# Altium schematic sheet MioShield.SchDoc
size A4
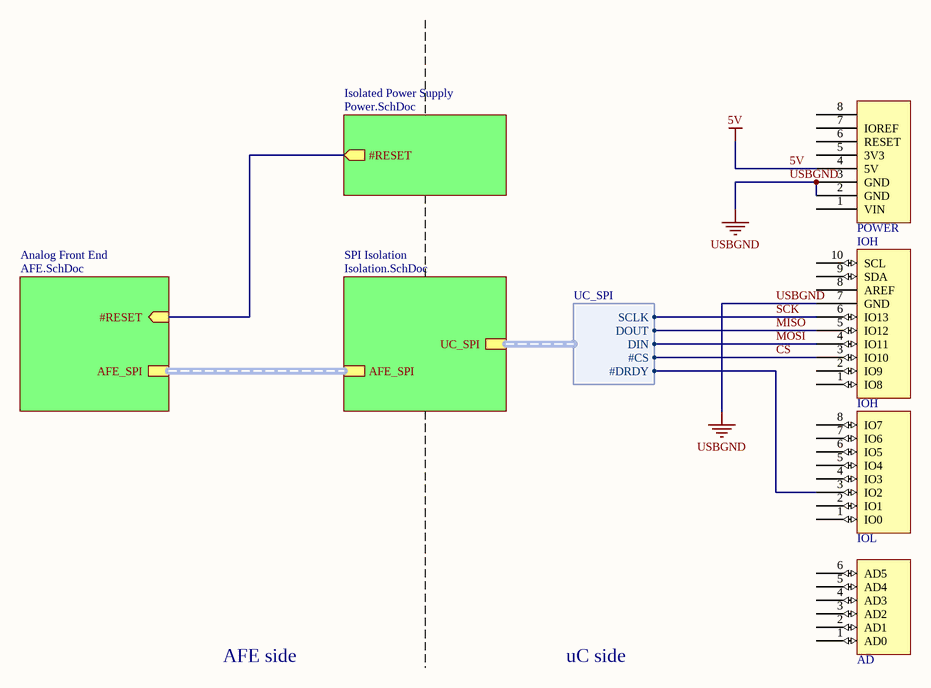
[diagram p0: MioShield.SchDoc]

## Parts
AD  AD  [Header 6x1 8.5mm]  (value not drawn)
IOH  IOH  [Header 10x1 8.5mm]
IOL  IOL  [Header 8x1 8.5mm]  (value not drawn)
POWER  POWER_UNO  [Header 8x1 8.5mm]  (value not drawn)

## Sub-sheets
Analog Front End = AFE.SchDoc: #RESET (in), AFE_SPI (harness AFE_SPI)
Isolated Power Supply = Power.SchDoc: #RESET (out)
SPI Isolation = Isolation.SchDoc: AFE_SPI (harness AFE_SPI), UC_SPI (harness UC_SPI)

## Harnesses
UC_SPI: #CS, #DRDY, DIN, DOUT, SCLK

## Nets
5V: POWER.4(5V)
USBGND: IOH.7(GND) POWER.2(GND) POWER.3(GND)
CS: IOH.3(IO10) ; sheet SPI Isolation/UC_SPI.#CS
MISO: IOH.5(IO12) ; sheet SPI Isolation/UC_SPI.DOUT
MOSI: IOH.4(IO11) ; sheet SPI Isolation/UC_SPI.DIN
SCK: IOH.6(IO13) ; sheet SPI Isolation/UC_SPI.SCLK
NetIOL_3: IOL.3(IO2) ; sheet SPI Isolation/UC_SPI.#DRDY
(unnamed): sheet Analog Front End/#RESET, sheet Isolated Power Supply/#RESET

Not connected (* = marked no-connect by the designer): AD 1(AD0) 2(AD1) 3(AD2) 4(AD3) 5(AD4) 6(AD5); IOH 1(IO8) 2(IO9) 8(AREF) 9(SDA) 10(SCL); IOL 1(IO0) 2(IO1) 4(IO3) 5(IO4) 6(IO5) 7(IO6) 8(IO7); POWER 1(VIN) 5(3V3) 6(RESET) 7(IOREF) 8

## Buses and harness runs
harness sheet Analog Front End/AFE_SPI = sheet SPI Isolation/AFE_SPI

## Notes on the sheet
- AFE side
- uC side